# Altium schematic sheet Blinker_Circuit_For_PCB.SchDoc
size A4
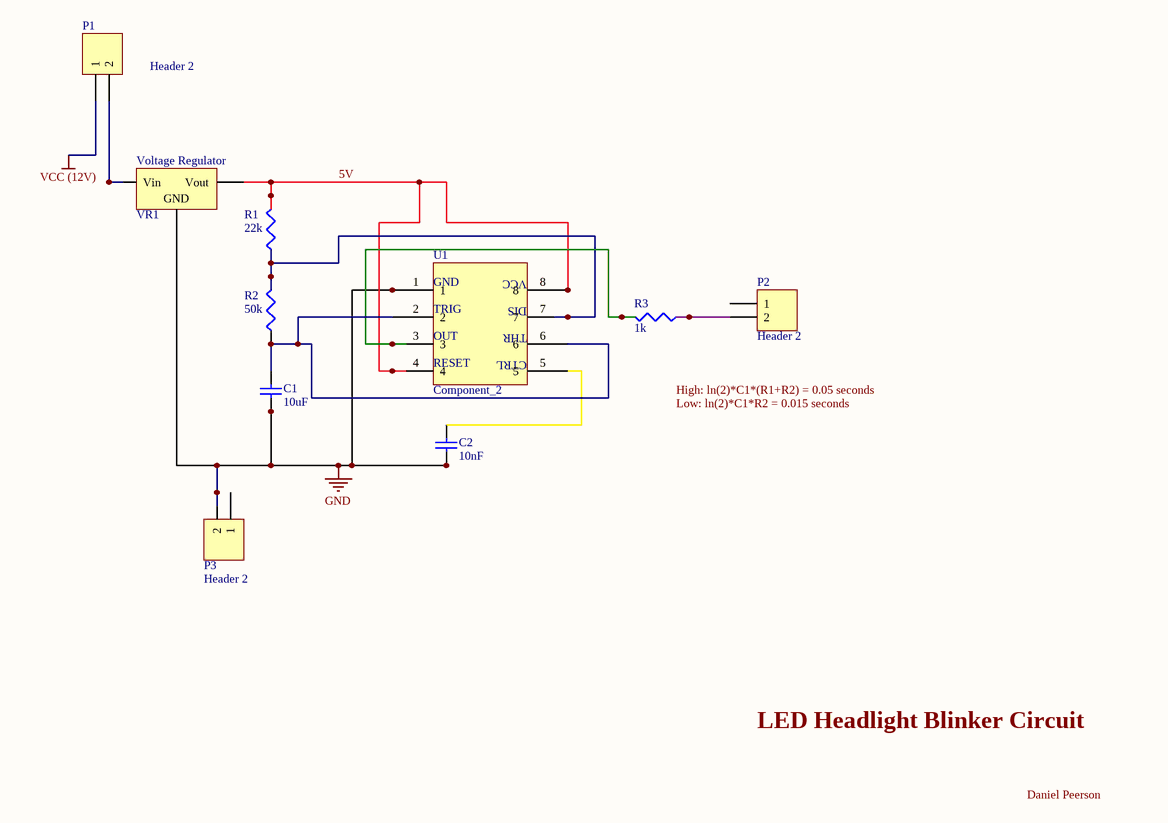
[diagram p0: Blinker_Circuit_For_PCB.SchDoc]

## Parts
C1  value 10uF  [C1206]  (hidden comment: Cap Semi)
C2  value 10nF  [C1206]  (hidden comment: Cap Semi)
P1  Header 2  [HDR1X2]
P2  Header 2  [HDR1X2]
P3  Header 2  [HDR1X2]
R1  value 22k  [14-1210]  (hidden comment: Res3)
R2  value 50k  [14-1210]  (hidden comment: Res3)
R3  value 1k  [14-1210]  (hidden comment: Res3)
U1  Component_2  [555]
VR1  Voltage Regulator  [D2PAK_N]

## Nets
GND: C1.1 C2.2 P3.2 U1.1 VR1.2(GND)
VCC (12V): P1.1
5V: R1.2 U1.4 U1.8 VR1.3(Vout)
NetC1_2: C1.2 R2.1 U1.2 U1.6
NetC2_1: C2.1 U1.5
NetP1_2: P1.2 VR1.1(Vin)
NetP2_2: P2.2 R3.1
NetR1_1: R1.1 R2.2 U1.7
NetR3_2: R3.2 U1.3

Not connected (* = marked no-connect by the designer): P2 1; P3 1

## Notes on the sheet
- Labels drawn without touching a wire or pin: Daniel Peerson, High: ln(2)*C1*(R1+R2) = 0.05 seconds, LED Headlight Blinker Circuit, Low: ln(2)*C1*R2 = 0.015 seconds
- (in symbol Component_2) VCC; GND; DIS; TRIG; THR; OUT; CTRL; RESET

## Library data of the parts
C1 C2 = Cap Semi: Capacitor (Semiconductor SIM Model); Published: 8-Jun-2000; LatestRevisionDate: 29-May-2009; LatestRevisionNote: IPC-7351 Footprint Added.; PackageReference: C1206; Publisher: Altium Limited; PackageDescription: Chip Capacitor
P1-P3 = Header 2: Header, 2-Pin; LatestRevisionDate: 17-Jul-2002; LatestRevisionNote: Re-released for DXP Platform.; Publisher: Altium Limited
R1-R3 = Res3: Resistor; Published: 8-Jun-2000; LatestRevisionDate: 29-May-2009; LatestRevisionNote: IPC-7351 Footprint Added.; PackageReference: J1-0603; Publisher: Altium Limited; PackageDescription: Chip Resistor
VR1 = Volt Reg: Published: 24-Mar-1999; LatestRevisionDate: 29-May-2009; LatestRevisionNote: IPC-7351 Footprint Added.; PackageReference: D2PAK; Publisher: Altium Limited; PackageDescription: 3-Pin Transistor Outline Package 2.54 mm Pitch, 15.1 mm Lead Span